# Altium schematic sheet power_supply.SchDoc
size A
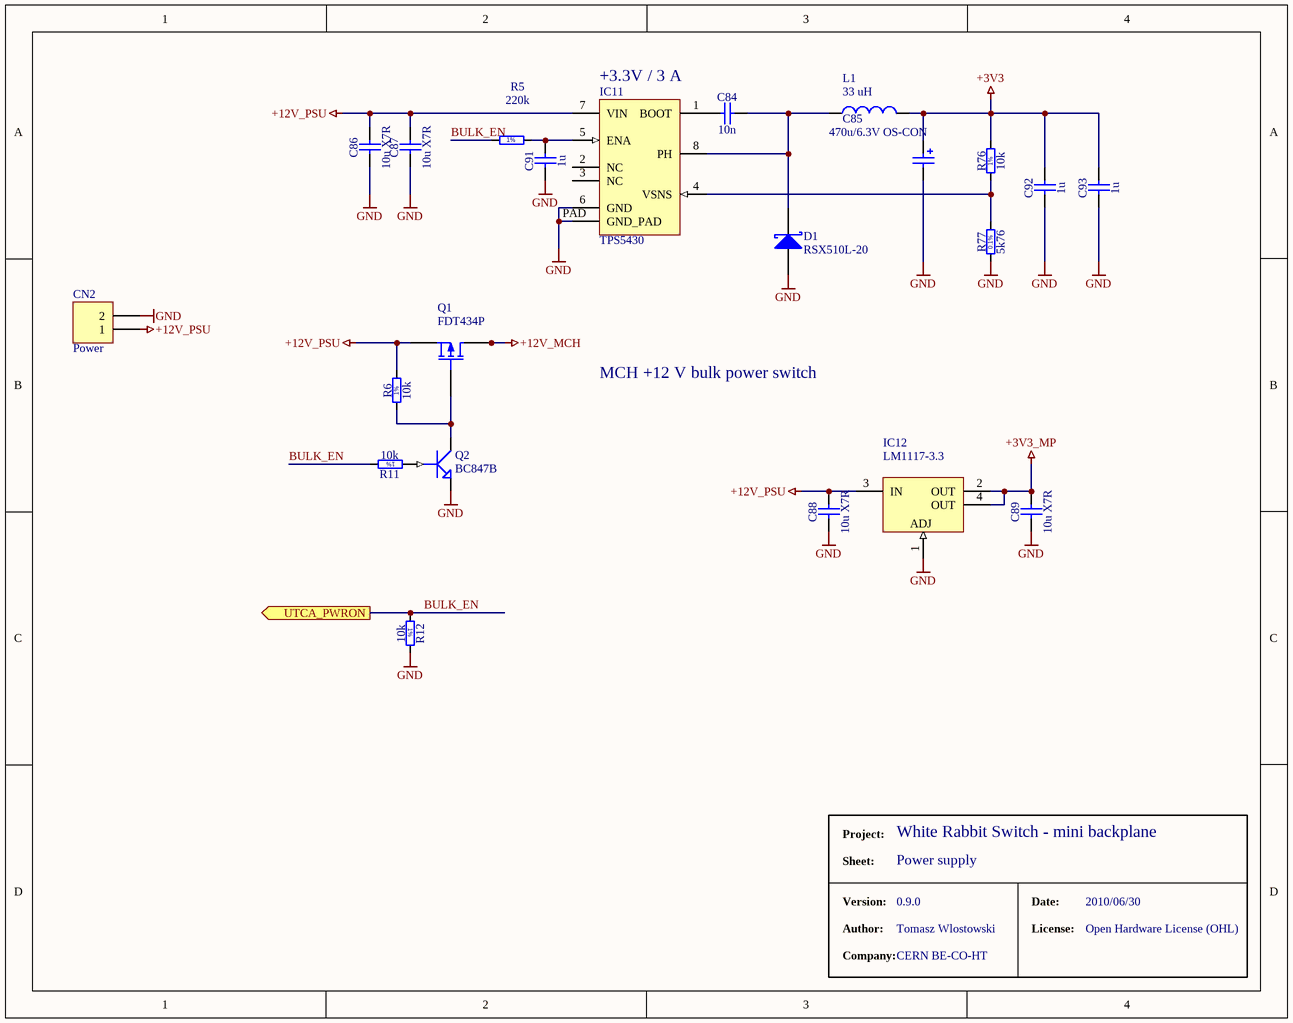
[diagram p0: power_supply.SchDoc]

## Parts
C84  10n  [CAPC1608X87N]
C85  470u/6.3V OS-CON  [OSCON_F12]
C86  10u X7R  [CAPC3216X140N]
C87  10u X7R  [CAPC3216X140N]
C88  10u X7R  [CAPC3216X140N]
C89  10u X7R  [CAPC3216X140N]
C91  1u  [CAPC1608X87N]
C92  1u  [CAPC3216X140N]
C93  1u  [CAPC3216X140N]
CN2  Power  [CON_3.96_2]
D1  RSX510L-20  [CD4532-1812]
IC11  TPS5430  [SOIC127P600-8AL_POWERPAD]
IC12  LM1117-3.3  [SOT223-4L]
L1  33 uH  [IND0943-B]
Q1  FDT434P  [SOT223-4L]
Q2  BC847B  [SOT-23]
R5  220k  [RESC1608X55N]
R6  10k  [RESC1608X55N]
R11  10k  [RESC1608X55N]
R12  10k  [RESC1608X55N]
R76  10k  [RESC1608X55N]
R77  5k76  [RESC1608X55N]

## Ports
UTCA_PWRON (out)

## Nets
+3V3: C85.1 C92.2 C93.2 L1.2 R76.2
+3V3_MP: C89.2 IC12.2(OUT) IC12.4(OUT)
+12V_MCH: Q1.2(D) Q1.4(D)
+12V_PSU: C86.2 C87.2 C88.2 CN2.1 IC11.7(VIN) IC12.3(IN) Q1.3(S) R6.2
GND: C85.2 C86.1 C87.1 C88.1 C89.1 C91.1 C92.1 C93.1 CN2.2 D1.1(A) IC11.6(GND) IC11.PAD(GND_PAD) IC12.1(ADJ) Q2.2(E) R12.2 R77.1
BULK_EN: R5.1 R11.2 R12.1 ; port UTCA_PWRON
NetC84_1: C84.1 IC11.1(BOOT)
NetC84_2: C84.2 D1.2(K) IC11.8(PH) L1.1
NetC91_2: C91.2 IC11.5(ENA) R5.2
NetIC11_4: IC11.4(VSNS) R76.1 R77.2
NetQ1_1: Q1.1(G) Q2.3(C) R6.1
NetQ2_1: Q2.1(B) R11.1

Not connected (* = marked no-connect by the designer): IC11 2(NC) 3(NC)

## Notes on the sheet
- +3.3V / 3 A
- MCH +12 V bulk power switch
- Project:
- White Rabbit Switch - mini backplane
- Sheet:
- Version:
- Power supply
- 0.9.0
- Date:
- 2010/06/30
- Author:
- Company:
- Tomasz Wlostowski
- CERN BE-CO-HT
- License:
- Open Hardware License (OHL)
- (in symbol R0603_5K76_0.1%_0.063W_10PPM) 0.1%
- (in symbol R0603_10K_1%_0.1W_100PPM) 1%
- (in symbol R0603_220K_1%_0.1W_100PPM) 1%

## Library data of the parts
C84 = CC0603_10NF_50V_10%_X7R: Non-polarised capacitor; Part Description: SMD Multilayer Chip Ceramic Capacitor; Manufacturer: GENERIC; Manufacturer1 Part Number: 223858615636; Value: 10nF; Voltage: 50V; TC: X7R; Tolerance: ±10%; Table: Capacitors SMD; Part Number: CC0603_10NF_50V_10%_X7R; Component Kind: Standard; Component Type: Standard; Pin Count: 2; Status: Preferred; Manufacturer Part Number: CC0603_10NF_50V_10%_X7R; Case: 0603; Mounted: Yes; Socket: No; SMD: Yes; Manufacturer1 Example: PHYCOMP; Manufacturer1 ComponentHeight: 0.87mm; HelpURL: \\cern.ch\dfs\Applications\Altium\Datasheets\CC0603_X7R_PHYCOMP.pdf; Author: CERN DEM JLC; CreateDate: 12/3/2007; LatestRevisionDate: 12/3/2007
C85 = Cap Pol1: Polarized Capacitor (Radial); Value: 6SVP470MX; Published: 8-Jun-2000; LatestRevisionDate: 17-Jul-2002; LatestRevisionNote: Re-released for DXP Platform.; PackageReference: RB7.6-15; Publisher: Altium Limited
C86-C89 = CC1206_10UF_16V_10%_X7R: Non-polarised capacitor; Part Description: SMD Multilayer Chip Ceramic Capacitor; Manufacturer: GENERIC; Manufacturer1 Part Number: C1206C106K4RAC; Value: 10uF; Voltage: 16V; Tolerance: ±10%; Table: Capacitors SMD; Part Number: CC1206_10UF_16V_10%_X7R; Component Kind: Standard; Component Type: Standard; Pin Count: 2; Status: Preferred; TC: X7R; Manufacturer Part Number: CC1206_10uF_16V_10%_X7R; Case: 1206; Mounted: Yes; Socket: No; SMD: Yes; Manufacturer1 Example: KEMET; Manufacturer1 ComponentHeight: 1.8mm; HelpURL: \\cern.ch\dfs\Applications\Altium\Datasheets\CC1206_X7R_KEMET.pdf; Author: CERN DEM JLC; CreateDate: 4/28/2009; LatestRevisionDate: 4/28/2009
C91 = CC0603_1UF_16V_10%_X7R: Non-polarised capacitor; Part Description: SMD Multilayer Chip Ceramic Capacitor; Manufacturer: GENERIC; Manufacturer1 Part Number: 223824613663; Value: 1uF; Voltage: 16V; TC: X7R; Tolerance: ±10%; Table: Capacitors SMD; Part Number: CC0603_1UF_16V_10%_X7R; Component Kind: Standard; Component Type: Standard; Pin Count: 2; Status: Preferred; Manufacturer Part Number: CC0603_1uF_16V_10%_X7R; Case: 0603; Mounted: Yes; Socket: No; SMD: Yes; Manufacturer1 Example: PHYCOMP; Manufacturer1 ComponentHeight: 0.87mm; HelpURL: \\cern.ch\dfs\Applications\Altium\Datasheets\CC0805_X5R_PHYCOMP_HC.pdf; Author: CERN DEM JLC; CreateDate: 12/3/2007; LatestRevisionDate: 12/3/2007
C92 C93 = CC1206_1UF_16V_10%_X7R: Non-polarised capacitor; Part Description: SMD Multilayer Chip Ceramic Capacitor; Manufacturer: GENERIC; Manufacturer1 Part Number: 2222 781 15663; Value: 1uF; Voltage: 16V; TC: X7R; Tolerance: ±10%; Table: Capacitors SMD; Part Number: CC1206_1UF_16V_10%_X7R; Component Kind: Standard; Component Type: Standard; Pin Count: 2; Status: Preferred; Manufacturer Part Number: CC1206_1UF_16V_10%_X7R; Case: 1206; Mounted: Yes; Socket: No; SMD: Yes; Manufacturer1 Example: PHYCOMP; Manufacturer1 ComponentHeight: 1.25mm; HelpURL: \\cern.ch\dfs\Applications\Altium\Datasheets\CC1206_X7R_PHYCOMP.pdf; Author: CERN DEM JLC; CreateDate: 12/3/2007; LatestRevisionDate: 12/3/2007
CN2 = Header 2: Header, 2-Pin; LatestRevisionDate: 17-Jul-2002; LatestRevisionNote: Re-released for DXP Platform.; Publisher: Altium Limited
D1 = D Schottky: Schottky Diode; Published: 8-Jun-2000; LatestRevisionDate: 17-Jul-2002; LatestRevisionNote: Re-released for DXP Platform.; PackageReference: SMB; Publisher: Altium Limited; Code_JEDEC: DO-214-AA
IC11 = TPS5430: Step-down switchmode converter
IC12 = 1117: Three-Terminal Adjustable Output Positive Voltage Regulator; Package Information: Latest Revision: 1997; Note: Heatsink surface connected to Pin 2; Code - JEDEC: TO-262-AA; Value: LM1117; Published: 15-Apr-2002; Datasheet: Latest Revision: 1996; Package Reference: 221A-06; Publisher: Altium Limited
L1 = Inductor: Code_IEC: 1005; Value: B82477P4333M000; Published: 8-Jun-2000; LatestRevisionDate: 17-Jul-2002; LatestRevisionNote: Re-released for DXP Platform.; PackageReference: 0402-A; Publisher: Altium Limited; Code_JEITA: 0402
Q1 = Q_FDT434P: P-Channel MOSFET; PackageDocument: 1995/1996; Published: 8-Jun-2000; LatestRevisionDate: 17-Jul-2002; LatestRevisionNote: Re-released for DXP Platform.; PackageReference: E3; Publisher: Altium Limited
Q2 = Q_BC847B: Transistor
R5 = R0603_220K_1%_0.1W_100PPM: Resistor - 1%; Part Description: General Purpose Thick Film Chip Resistor; Manufacturer: GENERIC; Manufacturer1 Part Number: NRC06F2203TRF; Power: 0.1W; TC: ±100ppm/°C; Table: Resistors SMD; Part Number: R0603_220K_1%_0.1W_100PPM; Component Kind: Standard; Component Type: Standard; Pin Count: 2; Value: 220k; Status: Preferred; Tolerance: ±1%; Manufacturer Part Number: R0603_220K_1%_0.1W_100PPM; Case: 0603; Mounted: Yes; Socket: No; SMD: Yes; Manufacturer1 Example: NIC COMPONENT; Manufacturer1 ComponentHeight: 0.55mm; HelpURL: \\cern.ch\dfs\Applications\Altium\Datasheets\R0603_NIC_NRC.pdf; Author: CERN DEM JLC; CreateDate: 12/3/2007; LatestRevisionDate: 3/13/2008
R6 R11 R12 R76 = R0603_10K_1%_0.1W_100PPM: Resistor - 1%; Part Description: General Purpose Thick Film Chip Resistor; Manufacturer: GENERIC; Manufacturer1 Part Number: NRC06F1002TRF; Power: 0.1W; TC: ±100ppm/°C; Table: Resistors SMD; Part Number: R0603_10K_1%_0.1W_100PPM; Component Kind: Standard; Component Type: Standard; Pin Count: 2; Value: 10k; Status: Preferred; Tolerance: ±1%; Manufacturer Part Number: R0603_10K_1%_0.1W_100PPM; Case: 0603; Mounted: Yes; Socket: No; SMD: Yes; Manufacturer1 Example: NIC COMPONENT; Manufacturer1 ComponentHeight: 0.55mm; HelpURL: \\cern.ch\dfs\Applications\Altium\Datasheets\R0603_NIC_NRC.pdf; Author: CERN DEM JLC; CreateDate: 12/3/2007; LatestRevisionDate: 3/13/2008
R77 = R0603_5K76_0.1%_0.063W_10PPM: Resistor - 0.1%; Part Description: Thin Film Chip Resistor; Manufacturer: GENERIC; Manufacturer1 Part Number: RN73C1J5K76BTDF; Power: 0.063W; TC: ±10ppm; Table: Resistors SMD; Part Number: R0603_5K76_0.1%_0.063W_10PPM; Component Kind: Standard; Component Type: Standard; Pin Count: 2; Value: 5k76; Status: Not recommended; Tolerance: ±0.1%; Manufacturer Part Number: R0603_5K76_0.1%_0.063W_10PPM; Case: 0603; Mounted: Yes; Socket: No; SMD: Yes; Manufacturer1 Example: TYCO HOLSWORTHY; Manufacturer1 ComponentHeight: 0.5mm; HelpURL: \\cern.ch\dfs\Applications\Altium\Datasheets\R0603_Tyco_RN73.pdf; Author: CERN DEM JLC; CreateDate: 12/3/2007; LatestRevisionDate: 3/13/2008